# Altium schematic sheet MCU.SchDoc: YUsend-QB50 OBC
size A2; DrawnBy: Konstantin Borschiov; Revision: B; SheetNumber: 1; SheetTotal: 2
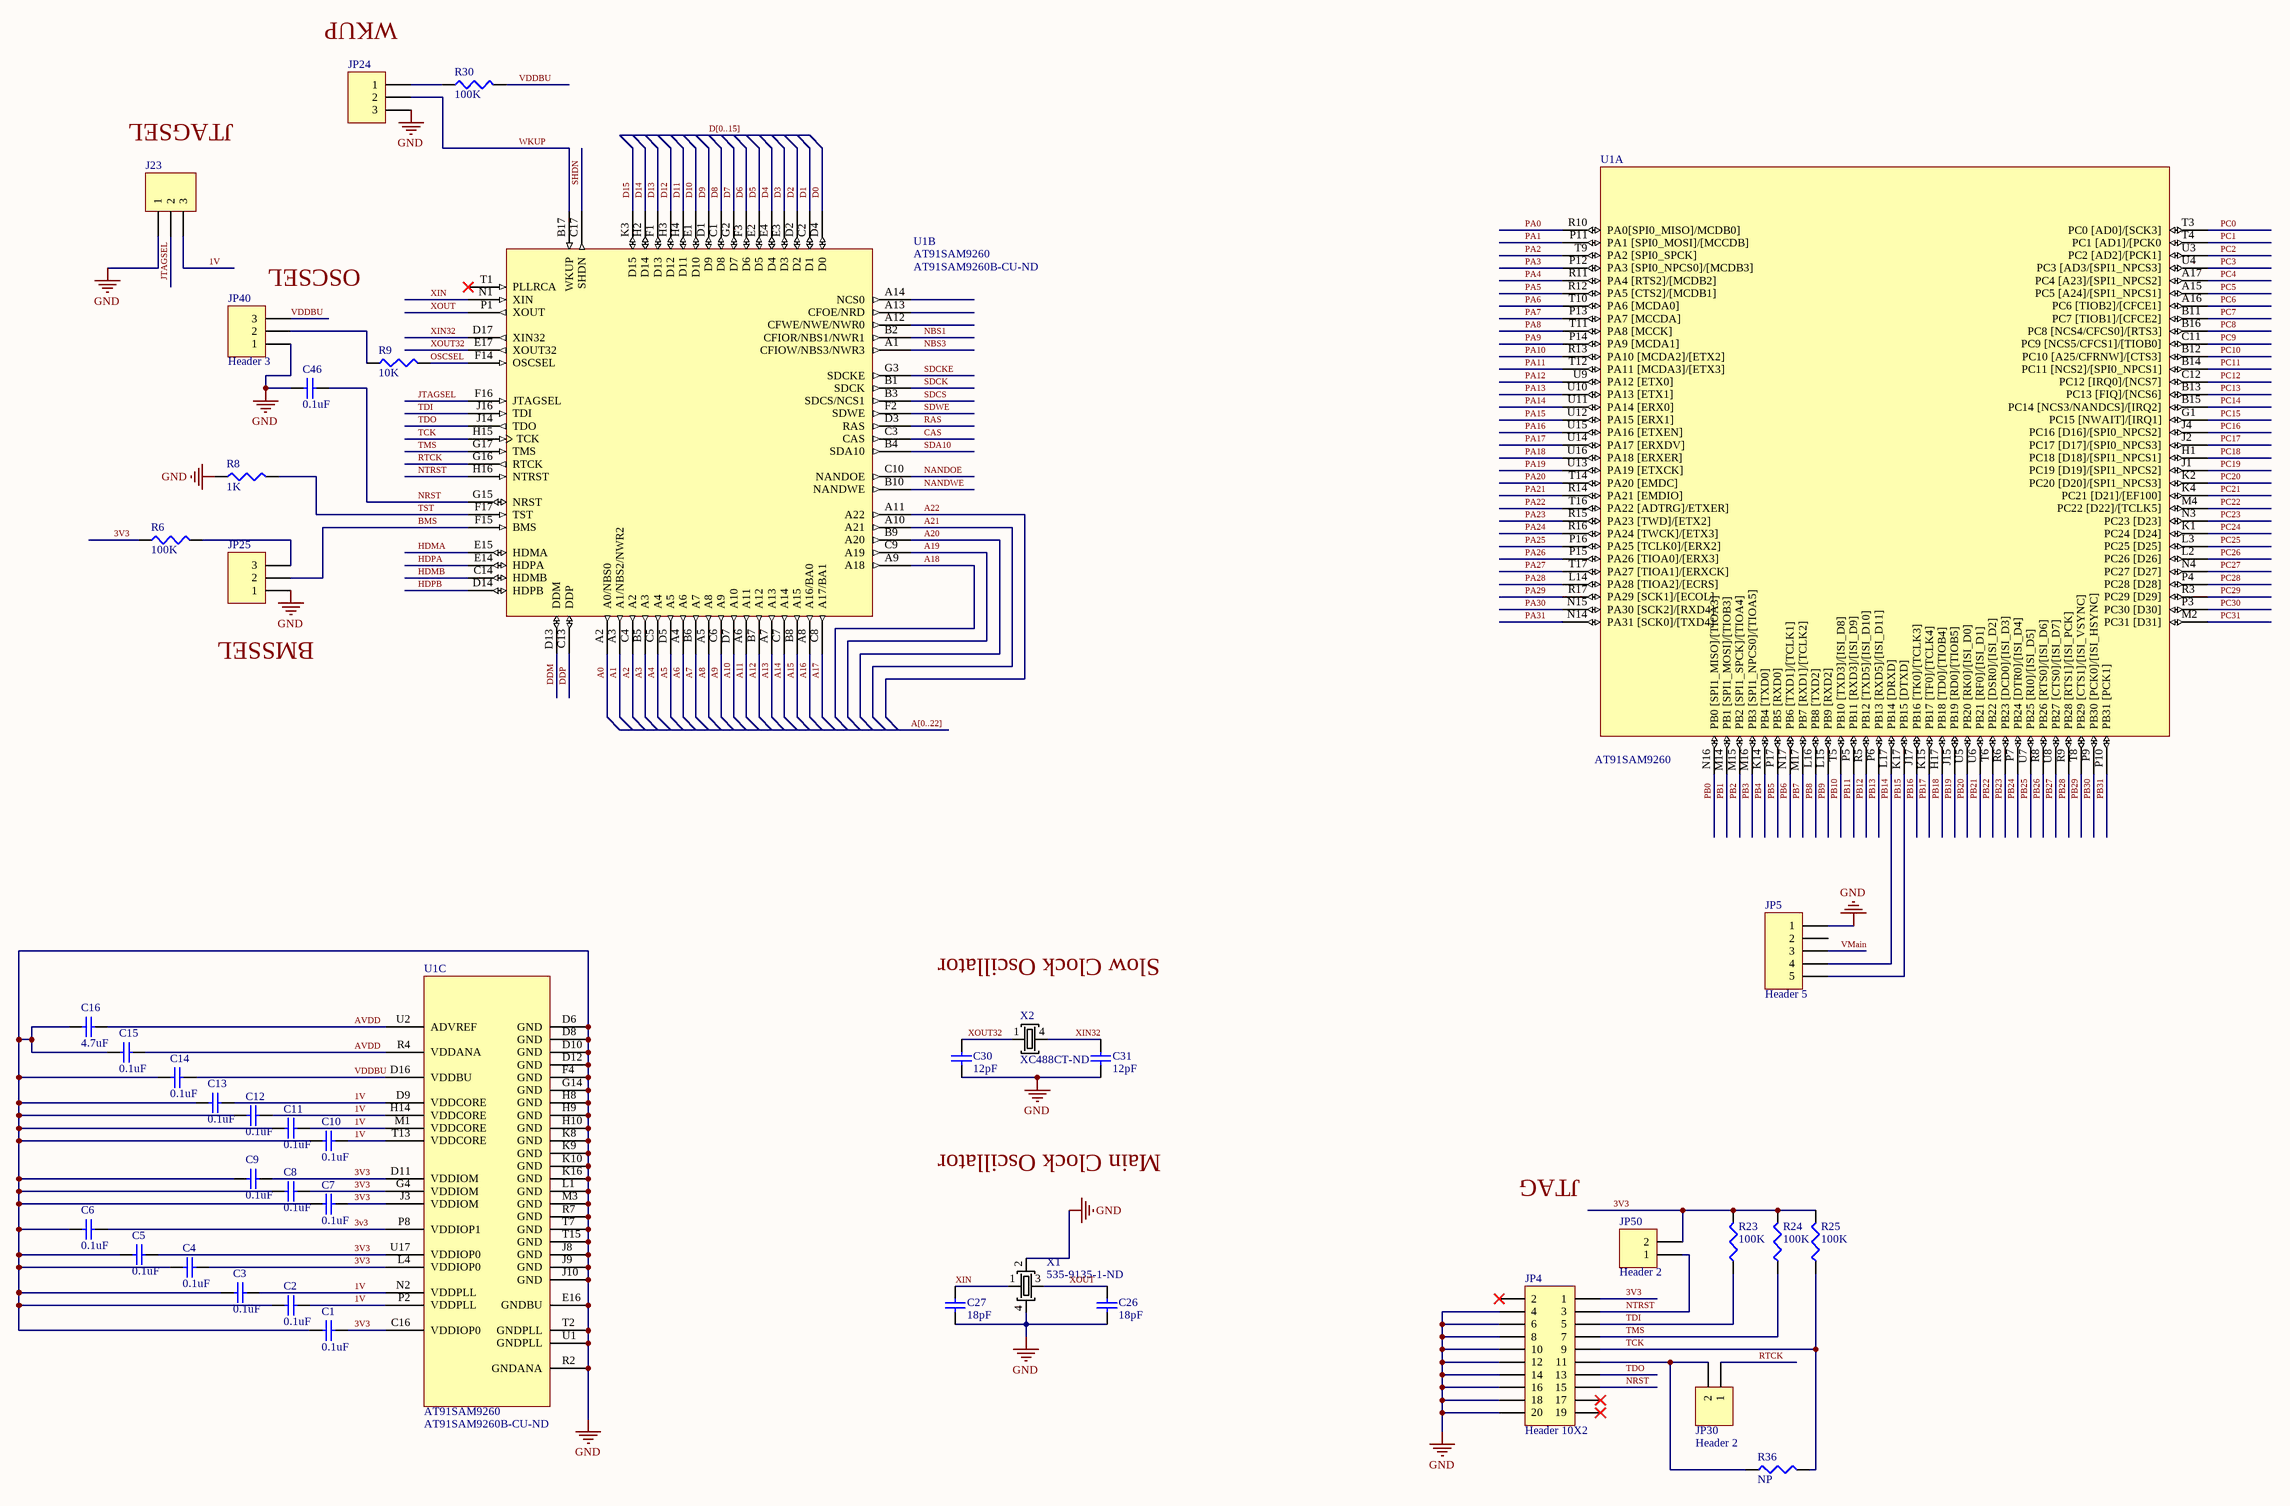
[diagram p0: MCU.SchDoc]

## Parts
C1  value 0.1uF  [0402]  (hidden comment: C0402_c_0.1uF)
C2  value 0.1uF  [0402]  (hidden comment: C0402_c_0.1uF)
C3  value 0.1uF  [0402]  (hidden comment: C0402_c_0.1uF)
C4  value 0.1uF  [0402]  (hidden comment: C0402_c_0.1uF)
C5  value 0.1uF  [0402]  (hidden comment: C0402_c_0.1uF)
C6  value 0.1uF  [0402]  (hidden comment: C0402_c_0.1uF)
C7  value 0.1uF  [0402]  (hidden comment: C0402_c_0.1uF)
C8  value 0.1uF  [0402]  (hidden comment: C0402_c_0.1uF)
C9  value 0.1uF  [0402]  (hidden comment: C0402_c_0.1uF)
C10  value 0.1uF  [0402]  (hidden comment: C0402_c_0.1uF)
C11  value 0.1uF  [0402]  (hidden comment: C0402_c_0.1uF)
C12  value 0.1uF  [0402]  (hidden comment: C0402_c_0.1uF)
C13  value 0.1uF  [0402]  (hidden comment: C0402_c_0.1uF)
C14  value 0.1uF  [0402]  (hidden comment: C0402_c_0.1uF)
C15  value 0.1uF  [0402]  (hidden comment: C0402_c_0.1uF)
C16  value 4.7uF  [0402]  (hidden comment: C0402_c_4.7uF)
C26  value 18pF  [0402]  (hidden comment: C0402_a_18pF)
C27  value 18pF  [0402]  (hidden comment: C0402_a_18pF)
C30  value 12pF  [0402]  (hidden comment: C0402_a_12pF)
C31  value 12pF  [0402]  (hidden comment: C0402_a_12pF)
C46  value 0.1uF  [0402]  (hidden comment: C0402_c_0.1uF)
J23  Header 3  [HDR1X3]  (value not drawn)
JP4  Header 10X2  [HDR2X10]
JP5  Header 5  [HDR1X5]
JP24  Header 3  [HDR1X3]  (value not drawn)
JP25  Header 3  [HDR1X3]  (value not drawn)
JP30  Header 2  [HDR1X2]
JP40  Header 3  [HDR1X3]
JP50  Header 2  [HDR1X2]
R6  value 100K  [RES0805]  (hidden comment: Susumu_0805_b3_100K)
R8  value 1K  [RES0805]  (hidden comment: Susumu_0805_b1_1K)
R9  value 10K  [RES0805]  (hidden comment: Susumu_0805_b2_10K)
R23  value 100K  [RES0805]  (hidden comment: Susumu_0805_b3_100K)
R24  value 100K  [RES0805]  (hidden comment: Susumu_0805_b3_100K)
R25  value 100K  [RES0805]  (hidden comment: Susumu_0805_b3_100K)
R30  value 100K  [RES0805]  (hidden comment: Susumu_0805_b3_100K)
R36  value NP  [RES0805]  (hidden comment: 0805_NP)
U1  AT91SAM9260  [BGA217C80P17X17_1500X1500X140]  (parts A,B,C of 3)
X1  Supplier Part Number 1: 535-9135-1-ND  [Crystal Footprint]  (hidden comment: Crystal_18.432MHz)
X2  Supplier Part Number 1: XC488CT-ND  [ECX-306]  (hidden comment: Crystal_32.768KHz)

## Nets
GND: C1.1 C2.1 C3.1 C4.1 C5.1 C6.1 C7.1 C8.1 C9.1 C10.1 C11.1 C12.1 C13.1 C14.1 C15.1 C16.1 C26.1 C27.1 C30.1 C31.1 C46.1 J23.1 JP4.4 JP4.6 JP4.8 JP4.10 JP4.12 JP4.14 JP4.16 JP4.18 JP4.20 JP5.1 JP24.3 JP25.1 JP40.1 R8.1 U1.D6(GND) U1.D8(GND) U1.D10(GND) U1.D12(GND) U1.E16(GNDBU) U1.F4(GND) U1.G14(GND) U1.H8(GND) U1.H9(GND) U1.H10(GND) U1.J8(GND) U1.J9(GND) U1.J10(GND) U1.K8(GND) U1.K9(GND) U1.K10(GND) U1.K16(GND) U1.L1(GND) U1.M3(GND) U1.R2(GNDANA) U1.R7(GND) U1.T2(GNDPLL) U1.T7(GND) U1.T15(GND) U1.U1(GNDPLL) X1.2(GND) X1.4(GND)
1V: C2.2 C3.2 C10.2 C11.2 C12.2 C13.2 J23.3 U1.D9(VDDCORE) U1.H14(VDDCORE) U1.M1(VDDCORE) U1.N2(VDDPLL) U1.P2(VDDPLL) U1.T13(VDDCORE)
3V3: C1.2 C4.2 C5.2 C6.2 C7.2 C8.2 C9.2 JP4.1 JP50.2 R6.1 R23.2 R24.2 R25.2 U1.C16(VDDIOP0) U1.D11(VDDIOM) U1.G4(VDDIOM) U1.J3(VDDIOM) U1.L4(VDDIOP0) U1.P8(VDDIOP1) U1.U17(VDDIOP0)
A0: U1.A2(A0/NBS0)
A1: U1.A3(A1/NBS2/NWR2)
A2: U1.C4(A2)
A3: U1.B5(A3)
A4: U1.C5(A4)
A5: U1.D5(A5)
A6: U1.A4(A6)
A7: U1.B6(A7)
A8: U1.A5(A8)
A9: U1.C6(A9)
A10: U1.D7(A10)
A11: U1.A6(A11)
A12: U1.B7(A12)
A13: U1.A7(A13)
A14: U1.C7(A14)
A15: U1.B8(A15)
A16: U1.A8(A16/BA0)
A17: U1.C8(A17/BA1)
A18: U1.A9(A18)
A19: U1.C9(A19)
A20: U1.B9(A20)
A21: U1.A10(A21)
A22: U1.A11(A22)
AVDD: C15.2 C16.2 U1.R4(VDDANA) U1.U2(ADVREF)
BMS: JP25.2 U1.F15(BMS)
CAS: U1.C3(CAS)
D0: U1.D4(D0)
D1: U1.C2(D1)
D2: U1.D2
D3: U1.E3(D3)
D4: U1.E4(D4)
D5: U1.E2(D5)
D6: U1.F3(D6)
D7: U1.G2(D7)
D8: U1.C1(D8)
D9: U1.D1(D9)
D10: U1.E1(D10)
D11: U1.H4(D11)
D12: U1.H3(D12)
D13: U1.F1(D13)
D14: U1.H2(D14)
D15: U1.K3(D15)
DDM: U1.D13(DDM)
DDP: U1.C13(DDP)
HDMA: U1.E15(HDMA)
HDMB: U1.C14(HDMB)
HDPA: U1.E14(HDPA)
HDPB: U1.D14(HDPB)
JTAGSEL: J23.2 U1.F16(JTAGSEL)
NANDOE: U1.C10(NANDOE)
NANDWE: U1.B10(NANDWE)
NBS1: U1.B2(CFIOR/NBS1/NWR1)
NBS3: U1.A1(CFIOW/NBS3/NWR3)
NRST: C46.2 JP4.15 U1.G15(NRST)
NTRST: JP4.3 JP50.1 U1.H16(NTRST)
OSCSEL: R9.2 U1.F14(OSCSEL)
PA0: U1.R10(PA0[SPI0_MISO]/MCDB0])
PA1: U1.P11(PA1_[SPI0_MOSI]/[MCCDB])
PA2: U1.T9(PA2_[SPI0_SPCK])
PA3: U1.P12(PA3_[SPI0_NPCS0]/[MCDB3])
PA4: U1.R11(PA4_[RTS2]/[MCDB2])
PA5: U1.R12(PA5_[CTS2]/[MCDB1])
PA6: U1.T10(PA6_[MCDA0])
PA7: U1.P13(PA7_[MCCDA])
PA8: U1.T11(PA8_[MCCK])
PA9: U1.P14(PA9_[MCDA1])
PA10: U1.R13(PA10_[MCDA2]/[ETX2])
PA11: U1.T12(PA11_[MCDA3]/[ETX3])
PA12: U1.U9(PA12_[ETX0])
PA13: U1.U10(PA13_[ETX1])
PA14: U1.U11(PA14_[ERX0])
PA15: U1.U12(PA15_[ERX1])
PA16: U1.U15(PA16_[ETXEN])
PA17: U1.U14(PA17_[ERXDV])
PA18: U1.U16(PA18_[ERXER])
PA19: U1.U13(PA19_[ETXCK])
PA20: U1.T14(PA20_[EMDC])
PA21: U1.R14(PA21_[EMDIO])
PA22: U1.T16(PA22_[ADTRG]/ETXER])
PA23: U1.R15(PA23_[TWD]/[ETX2])
PA24: U1.R16(PA24_[TWCK]/[ETX3])
PA25: U1.P16(PA25_[TCLK0]/[ERX2])
PA26: U1.P15(PA26_[TIOA0]/[ERX3])
PA27: U1.T17(PA27_[TIOA1]/[ERXCK])
PA28: U1.L14(PA28_[TIOA2]/[ECRS])
PA29: U1.R17(PA29_[SCK1]/[ECOL])
PA30: U1.N15(PA30_[SCK2]/[RXD4])
PA31: U1.N14(PA31_[SCK0]/[TXD4])
PB0: U1.N16(PB0_[SPI1_MISO]/[TIOA3])
PB1: U1.M14(PB1_[SPI1_MOSI]/[TIOB3])
PB2: U1.M15(PB2_[SPI1_SPCK]/[TIOA4])
PB3: U1.M16(PB3_[SPI1_NPCS0]/[TIOA5])
PB4: U1.K14(PB4_[TXD0])
PB5: U1.P17(PB5_[RXD0])
PB6: U1.N17(PB6_[TXD1]/[TCLK1])
PB7: U1.M17(PB7_[RXD1]/[TCLK2])
PB8: U1.L16(PB8_[TXD2])
PB9: U1.L15(PB9_[RXD2])
PB10: U1.T5(PB10_[TXD3]/[ISI_D8])
PB11: U1.P5(PB11_[RXD3]/[ISI_D9])
PB12: U1.R5(PB12_[TXD5]/[ISI_D10])
PB13: U1.P6(PB13_[RXD5]/[ISI_D11])
PB14: JP5.4 U1.L17(PB14_[DRXD])
PB15: JP5.5 U1.K17(PB15_[DTXD])
PB16: U1.J17(PB16_[TK0]/[TCLK3])
PB17: U1.K15(PB17_[TF0]/[TCLK4])
PB18: U1.H17(PB18_[TD0]/[TIOB4])
PB19: U1.J15(PB19_[RD0]/[TIOB5])
PB20: U1.U5(PB20_[RK0]/[ISI_D0])
PB21: U1.U6(PB21_[RF0]/[ISI_D1])
PB22: U1.T6(PB22_[DSR0]/[ISI_D2])
PB23: U1.R6(PB23_[DCD0]/[ISI_D3])
PB24: U1.P7(PB24_[DTR0]/[ISI_D4])
PB25: U1.U7(PB25_[RI0]/[ISI_D5])
PB26: U1.R8(PB26_[RTS0]/[ISI_D6])
PB27: U1.U8(PB27_[CTS0]/[ISI_D7])
PB28: U1.R9(PB28_[RTS1]/[ISI_PCK])
PB29: U1.T8(PB29_[CTS1]/[ISI_VSYNC])
PB30: U1.P9(PB30_[PCK0]/[ISI_HSYNC])
PB31: U1.P10(PB31_[PCK1])
PC0: U1.T3(PC0_[AD0]/[SCK3])
PC1: U1.T4(PC1_[AD1]/[PCK0)
PC2: U1.U3(PC2_[AD2]/[PCK1])
PC3: U1.U4(PC3_[AD3/[SPI1_NPCS3])
PC4: U1.A17(PC4_[A23]/[SPI1_NPCS2])
PC5: U1.A15(PC5_[A24]/[SPI1_NPCS1])
PC6: U1.A16(PC6_[TIOB2]/[CFCE1])
PC7: U1.B11(PC7_[TIOB1]/[CFCE2])
PC8: U1.B16(PC8_[NCS4/CFCS0]/[RTS3])
PC9: U1.C11(PC9_[NCS5/CFCS1]/[TIOB0])
PC10: U1.B12(PC10_[A25/CFRNW]/[CTS3])
PC11: U1.B14(PC11_[NCS2]/[SPI0_NPCS1])
PC12: U1.C12(PC12_[IRQ0]/[NCS7])
PC13: U1.B13(PC13_[FIQ]/[NCS6])
PC14: U1.B15(PC14_[NCS3/NANDCS]/[IRQ2])
PC15: U1.G1(PC15_[NWAIT]/[IRQ1])
PC16: U1.J4(PC16_[D16]/[SPI0_NPCS2])
PC17: U1.J2(PC17_[D17]/[SPI0_NPCS3])
PC18: U1.H1(PC18_[D18]/[SPI1_NPCS1])
PC19: U1.J1(PC19_[D19]/[SPI1_NPCS2])
PC20: U1.K2(PC20_[D20]/[SPI1_NPCS3])
PC21: U1.K4(PC21_[D21]/[EF100])
PC22: U1.M4(PC22_[D22]/[TCLK5])
PC23: U1.N3(PC23_[D23])
PC24: U1.K1(PC24_[D24])
PC25: U1.L3(PC25_[D25])
PC26: U1.L2(PC26_[D26])
PC27: U1.N4(PC27_[D27])
PC28: U1.P4(PC28_[D28])
PC29: U1.R3(PC29_[D29])
PC30: U1.P3(PC30_[D30])
PC31: U1.M2(PC31_[D31])
RAS: U1.D3(RAS)
RTCK: JP30.1 U1.G16(RTCK)
SDA10: U1.B4(SDA10)
SDCK: U1.B1(SDCK)
SDCKE: U1.G3(SDCKE)
SDCS: U1.B3(SDCS/NCS1)
SDWE: U1.F2(SDWE)
SHDN: U1.C17(SHDN)
TCK: JP4.9 R25.1 R36.2 U1.H15(TCK)
TDI: JP4.5 R23.1 U1.J16(TDI)
TDO: JP4.13 U1.J14(TDO)
TMS: JP4.7 R24.1 U1.G17(TMS)
TST: R8.2 U1.F17(TST)
VDDBU: C14.2 JP40.3 R30.2 U1.D16(VDDBU)
VMain: JP5.3
WKUP: JP24.2 U1.B17(WKUP)
XIN: C27.2 U1.N1(XIN) X1.1
XIN32: C31.2 U1.D17(XIN32) X2.4(GND)
XOUT: C26.2 U1.P1(XOUT) X1.3
XOUT32: C30.2 U1.E17(XOUT32) X2.1
NetJP4_11: JP4.11 JP30.2 R36.1
NetJP24_1: JP24.1 R30.1
NetJP25_3: JP25.3 R6.2
NetJP40_2: JP40.2 R9.1

Not connected (* = marked no-connect by the designer): JP4 2* 17* 19*; JP5 2; U1 A12(CFWE/NWE/NWR0) A13(CFOE/NRD) A14(NCS0) T1(PLLRCA)*

## Buses and harness runs
bus A[0..22]
bus D[0..15]

## Notes on the sheet
- (near JP24) WKUP
- JTAGSEL
- (near JP40) OSCSEL
- (near JP25) BMSSEL
- Slow Clock Oscillator
- Main Clock Oscillator
- JTAG

## Library data of the parts
C1-C15 C46 = C0402_c_0.1uF: Ceramic Chip Capacitor - 0.1uF; Note: Footprint corresponds to dimensions for bulk cassette packaging. This case size has tightened tolerances.; Published: 17-Jul-2002; LatestRevisionDate: 19-Mar-2004; LatestRevisionNote: Silkscreen size reduced.; DatasheetDocument: Mar-2001; PackageDocument: Mar-2001; PackageReference: 0402; Publisher: Altium Limited; Code_JEITA: 0402; Code_IPC: 1005 [0402]; ComponentLink1Description: Manufacturer Link; ComponentLink1URL: http://www.kemet.com/; ComponentLink2Description: Datasheet; ComponentLink2URL: http://www.kemet.com/kemet/web/homepage/kechome.nsf/vapubfilesname/F3102TA.pdf/$file/F3102TA.pdf; Supplier 1: Digi-Key; Supplier Part Number 1: 399-3521-1-ND
C16 = C0402_c_4.7uF: Ceramic Chip Capacitor - 4.7uF; Note: Footprint corresponds to dimensions for bulk cassette packaging. This case size has tightened tolerances.; Published: 17-Jul-2002; LatestRevisionDate: 19-Mar-2004; LatestRevisionNote: Silkscreen size reduced.; DatasheetDocument: Mar-2001; PackageDocument: Mar-2001; PackageReference: 0402; Publisher: Altium Limited; Code_JEITA: 0402; Code_IPC: 1005 [0402]; ComponentLink1Description: Manufacturer Link; ComponentLink1URL: http://www.kemet.com/; ComponentLink2Description: Datasheet; ComponentLink2URL: http://www.kemet.com/kemet/web/homepage/kechome.nsf/vapubfilesname/F3102TA.pdf/$file/F3102TA.pdf; Supplier 1: Digi-Key; Supplier Part Number 1: 490-5408-1-ND
C26 C27 = C0402_a_18pF: Ceramic Chip Capacitor - 18pF; Note: Footprint corresponds to dimensions for bulk cassette packaging. This case size has tightened tolerances.; Published: 17-Jul-2002; LatestRevisionDate: 19-Mar-2004; LatestRevisionNote: Silkscreen size reduced.; DatasheetDocument: Mar-2001; PackageDocument: Mar-2001; PackageReference: 0402; Publisher: Altium Limited; Code_JEITA: 0402; Code_IPC: 1005 [0402]; ComponentLink1Description: Manufacturer Link; ComponentLink1URL: http://www.kemet.com/; ComponentLink2Description: Datasheet; ComponentLink2URL: http://www.kemet.com/kemet/web/homepage/kechome.nsf/vapubfilesname/F3102TA.pdf/$file/F3102TA.pdf; Supplier 1: Digi-Key; Supplier Part Number 1: 490-1281-1-ND
C30 C31 = C0402_a_12pF: Ceramic Chip Capacitor - 12pF; Note: Footprint corresponds to dimensions for bulk cassette packaging. This case size has tightened tolerances.; Published: 17-Jul-2002; LatestRevisionDate: 19-Mar-2004; LatestRevisionNote: Silkscreen size reduced.; DatasheetDocument: Mar-2001; PackageDocument: Mar-2001; PackageReference: 0402; Publisher: Altium Limited; Code_JEITA: 0402; Code_IPC: 1005 [0402]; ComponentLink1Description: Manufacturer Link; ComponentLink1URL: http://www.kemet.com/; ComponentLink2Description: Datasheet; ComponentLink2URL: http://www.kemet.com/kemet/web/homepage/kechome.nsf/vapubfilesname/F3102TA.pdf/$file/F3102TA.pdf; Supplier 1: Digi-Key; Supplier Part Number 1: 490-1279-1-ND
J23 JP24 JP25 JP40 = Header 3: Header, 3-Pin; LatestRevisionDate: 17-Jul-2002; LatestRevisionNote: Re-released for DXP Platform.; Publisher: Altium Limited
JP4 = Header 10X2: Header, 10-Pin, Dual row; LatestRevisionDate: 17-Jul-2002; LatestRevisionNote: Re-released for DXP Platform.; Publisher: Altium Limited
JP5 = Header 5: Header, 5-Pin; LatestRevisionDate: 17-Jul-2002; LatestRevisionNote: Re-released for DXP Platform.; Publisher: Altium Limited
JP30 JP50 = Header 2: Header, 2-Pin; LatestRevisionDate: 17-Jul-2002; LatestRevisionNote: Re-released for DXP Platform.; Publisher: Altium Limited
R6 R23-R25 R30 = Susumu_0805_b3_100K: RES 100K OHM 1/10W .5% 0805 SMD; Supplier 1: Digi-Key; Supplier Part Number 1: RR12P100KDCT-ND
R8 = Susumu_0805_b1_1K: RES 1.0K OHM 1/10W .5% 0805 SMD; Supplier 1: Digi-Key; Supplier Part Number 1: RR12P1.0KDCT-ND
R9 = Susumu_0805_b2_10K: RES 10.0K OHM 1/10W .5% 0805 SMD; Supplier 1: Digi-Key; Supplier Part Number 1: RR12P10.0KDCT-ND
R36 = 0805_NP: No populate
U1 = AT91SAM9260: ARM926EJ-S 32 bit RISC CPU, 217-Ball BGA; Note: The pin names in [ ] brackets indicate peripheral multiplexing function.; ComponentLink1Description: Manufacturer Link; ComponentLink1URL: http://www.atmel.com; ComponentLink2Description: Datasheet; ComponentLink2URL: http://www.atmel.com/dyn/resources/prod_documents/doc6221.pdf; DatasheetVersion: 6221I-ATARM-17-Jul-09; PackageDescription: 217-Ball Ball Grid Array 0.8 mm Pitch; PackageReference: BGA217; Supplier 1: Digi-Key
X1 = Crystal_18.432MHz: Crystal 18.432MHz 18PF SMD; Manufacturer: Abracon Corporation; Value: 18.432MHz; Supplier 1: Digi-Key
X2 = Crystal_32.768KHz: Crystal 32.768KHz 12.5PF SMD; Value: 32.768KHz; Supplier 1: Digi-Key